# EAGLE design payload2 (EAGLE 8.3.2)
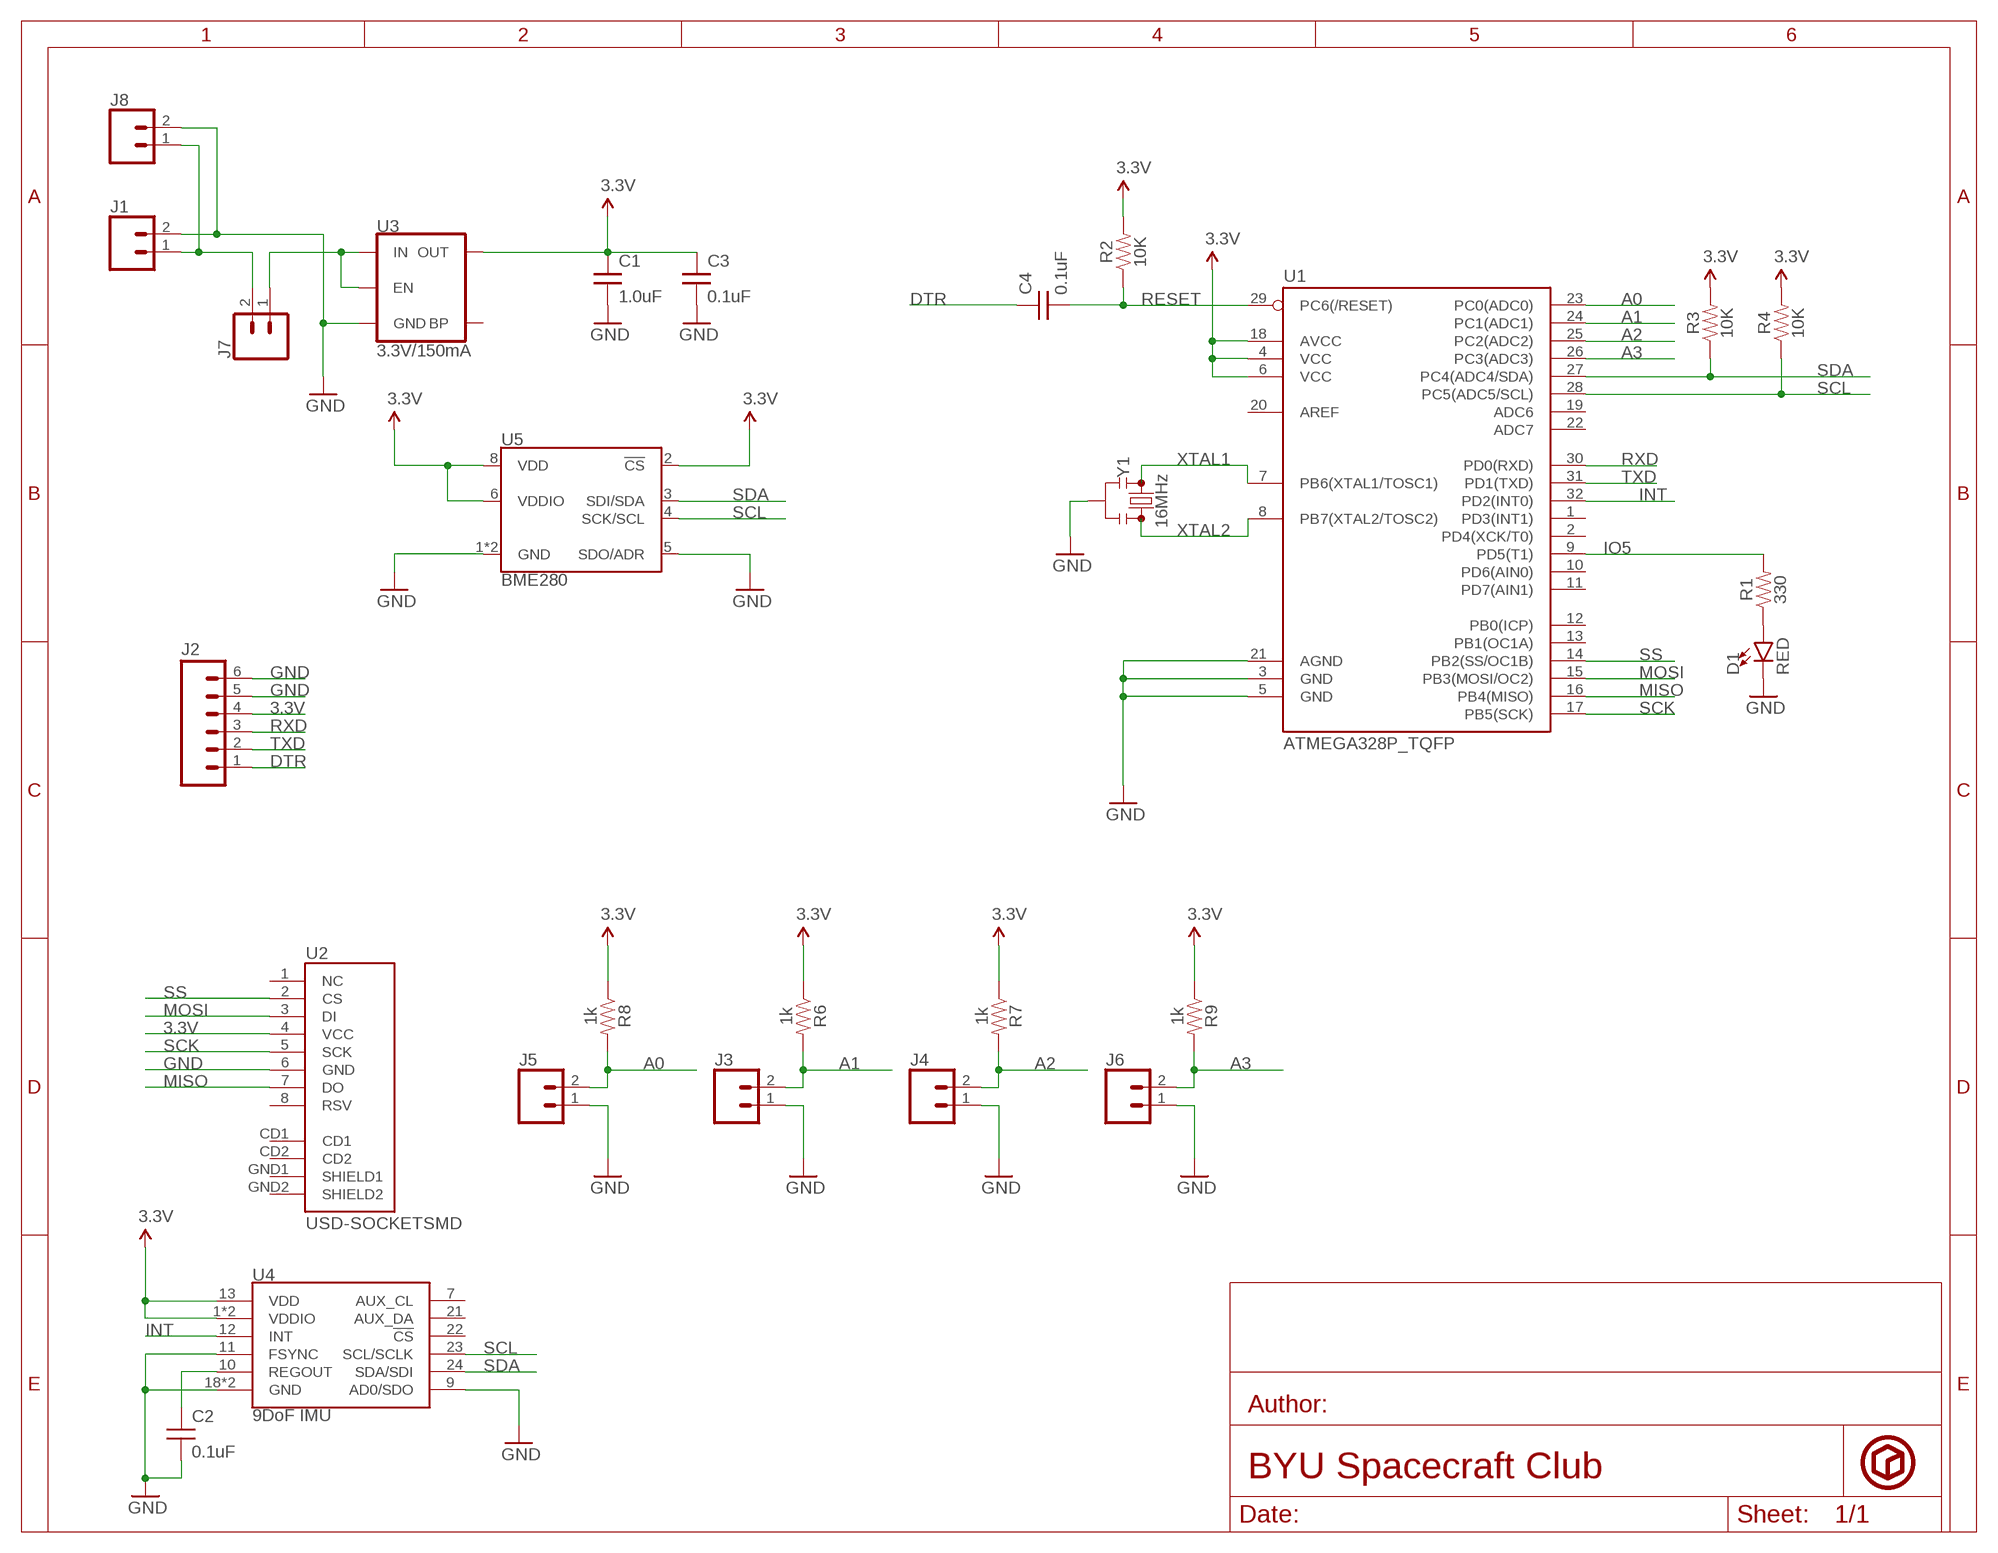
[diagram p0: schematic, sheet 1]

## Parts
C1  1.0uF  CAPACITOR_1.0UF-0603-16V-10%  [0603]
C2  0.1uF  CAPACITOR_0.1UF  [0603-CAP]
C3  0.1uF  CAPACITOR_0.1UF  [0603-CAP]
C4  0.1uF  CAPACITOR_0.1UF  [0603-CAP]
D1  RED  LED_RED0603  [LED-0603]
J1  CONN_02  [1X02]
J2  CONNECTOR_6PINSILK_FEMALE_PTH  [1X06]
J3  CONN_02  [1X02]
J4  CONN_02  [1X02]
J5  CONN_02  [1X02]
J6  CONN_02  [1X02]
J7  CONN_02  [1X02]
J8  CONN_02  [1X02]
R1  330  RESISTOR_330OHM-0603-1/10W-1%  [0603]
R2  10K  RESISTOR_10KOHM0603  [0603-RES]
R3  10K  RESISTOR_10KOHM0603  [0603-RES]
R4  10K  RESISTOR_10KOHM0603  [0603-RES]
R6  1k  RESISTOR_1KOHM-0603-1/10W-5%  [0603]
R7  1k  RESISTOR_1KOHM-0603-1/10W-5%  [0603]
R8  1k  RESISTOR_1KOHM-0603-1/10W-5%  [0603]
R9  1k  RESISTOR_1KOHM-0603-1/10W-5%  [0603]
U1  ATMEGA328P_TQFP  [TQFP32-08]
U2  USD-SOCKETSMD  [MICRO-SD-SOCKET-PP]
U3  3.3V/150mA  VOLTAGE_REGULATOR_MIC52053.3V  [SOT23-5]
U4  9DoF IMU  MPU9250  [QFN24-3X3]
U5  BME280  [LGA-8-2.5X2.5]
Y1  16MHz  RESONATOR_16MHZSMD_3.2X1.3  [RESONATOR-SMD-3.2X1.3]

## Nets
3.3V: C1.1 C3.1 J2.4 R2.2 R3.2 R4.2 R6.1 R7.1 R8.1 R9.1 U1.4(VCC) U1.6(VCC) U1.18(AVCC) U2.4(VCC) U3.5(OUT) U4.1(VDDIO) U4.8(VDDIO) U4.13(VDD) U5.2(!CS) U5.6(VDDIO) U5.8(VDD)
A0: J5.2 R8.2 U1.23(PC0(ADC0))
A1: J3.2 R6.2 U1.24(PC1(ADC1))
A2: J4.2 R7.2 U1.25(PC2(ADC2))
A3: J6.2 R9.2 U1.26(PC3(ADC3))
DTR: C4.1 J2.1
GND: C1.2 C2.2 C3.2 D1.C J1.2 J2.5 J2.6 J3.1 J4.1 J5.1 J6.1 J8.2 U1.3(GND) U1.5(GND) U1.21(AGND) U2.6(GND) U3.2(GND) U4.9(AD0/SDO) U4.11(FSYNC) U4.18(GND) U4.20(GND) U5.1(GND) U5.5(SDO/ADR) U5.7(GND) Y1.2
INT: U1.32(PD2(INT0)) U4.12(INT)
IO5: R1.2 U1.9(PD5(T1))
MISO: U1.16(PB4(MISO)) U2.7(DO)
MOSI: U1.15(PB3(MOSI/OC2)) U2.3(DI)
N$4: J7.1 U3.1(IN) U3.3(EN)
N$6: D1.A R1.1
N$7: C2.1 U4.10(REGOUT)
RESET: C4.2 R2.1 U1.29(PC6(/RESET))
RXD: J2.3 U1.30(PD0(RXD))
SCK: U1.17(PB5(SCK)) U2.5(SCK)
SCL: R4.1 U1.28(PC5(ADC5/SCL)) U4.23(SCL/SCLK) U5.4(SCK/SCL)
SDA: R3.1 U1.27(PC4(ADC4/SDA)) U4.24(SDA/SDI) U5.3(SDI/SDA)
SS: U1.14(PB2(SS/OC1B)) U2.2(CS)
TXD: J2.2 U1.31(PD1(TXD))
VIN: J1.1 J7.2 J8.1
XTAL1: U1.7(PB6(XTAL1/TOSC1)) Y1.1
XTAL2: U1.8(PB7(XTAL2/TOSC2)) Y1.3
Unconnected: U1.1(PD3(INT1)) U1.2(PD4(XCK/T0)) U1.10(PD6(AIN0)) U1.11(PD7(AIN1)) U1.12(PB0(ICP)) U1.13(PB1(OC1A)) U1.19(ADC6) U1.20(AREF) U1.22(ADC7) U2.1(NC) U2.8(RSV) U2.CD1 U2.CD2 U2.GND1(SHIELD1) U2.GND2(SHIELD2) U3.4(BP) U4.7(AUX_CL) U4.21(AUX_DA) U4.22(!CS)

## Library data of the parts
C1 = femtosat:CAPACITOR_1.0UF: 1µF ceramic capacitors A capacitor is a passive two-terminal electrical component used to store electrical energy temporarily in an electric field.; DIGIKEY: 399-3118-1-ND
C2-C4 = femtosat:CAPACITOR_0.1UF: CAP-00810 Ceramic Standard decoupling cap; DIGIKEY: 311-1343-1-ND
D1 = femtosat:LED_RED: Red SMD LED Used in manufacturing of most products at SparkFun Packages: 0603 - SMD 0603 package [Product Link] <http://docs.avagotech.com/docs/AV02-0551EN> Adapted from SparkFun Libraries; DIGIKEY: 160-1181-1-ND
J1 J3-J8 = SparkFun-Connectors:CONN_02: Multi connection point. Often used as Generic Header-pin footprint for 0.1 inch spaced/style header connections On any of the 0.1 inch spaced packages, you can populate with these: Break Away Headers - Straight <https://www.sparkfun.com/products/116> (PRT-00116) Break Away Male Headers - Right Angle <https://www.sparkfun.com/products/553> (PRT-00553) Female Headers <https://www.sparkfun.com/products/115> (PRT-00115) Break Away Headers - Machine Pin <https://www.sparkfun.com/products/117> (PRT-00117) Break Away Female Headers - Swiss Machine Pin <https://www.sparkfun.com/products/743> (PRT-00743) For SCREWTERMINALS and SPRING TERMINALS visit here: Screw Terimnals on SparkFun.com <https://www.sparkfun.com/search/results?term=Screw+Terminals> (5mm/3.5mm/2.54mm spacing) This device is also useful as a general connection point to wire up your design to another part of your project. Our various solder wires solder well into these plated through hole pads. Hook-Up Wire - Assortment (Stranded, 22 AWG) <https://www.sparkfun.com/products/11375> (PRT-11375) Hook-Up Wire - Assortment (Solid Core, 22 AWG) <https://www.sparkfun.com/products/11367> (PRT-11367) View the entire wire category on our website here <https://www.sparkfun.com/categories/141> Special notes: Molex polarized connector foot print use with: PRT-08233 with associated crimp pins and housings. 2.54_SCREWTERM for use with PRT-10571. 3.5mm Screw Terminal footprints for PRT-08084 5mm Screw Terminal footprints for use with PRT-08432
J2 = femtosat:CONNECTOR_6PIN: 6 pin connection point. Used on the femtosat for a programming connector. The ECEN shop stocks these regularly NOTES ON THE VARIANTS LOCK and LOCK_LONGPADS... This footprint was designed to help hold the alignment of a through-hole component (i.e. 6-pin header) while soldering it into place. You may notice that each hole has been shifted either up or down by 0.005 of an inch from it's more standard position (which is a perfectly straight line). This slight alteration caused the pins (the squares in the middle) to touch the edges of the holes. Because they are alternating, it causes a "brace" to hold the component in place. 0.005 has proven to be the perfect amount of "off-center" position when using our standard breakaway headers. Although looks a little odd when you look at the bare footprint, once you have a header in there, the alteration is very hard to notice. Also, if you push a header all the way into place, it is covered up entirely on the bottom side.
R1 = femtosat:RESISTOR_330OHM: 330 Ohm resistor A resistor is a passive two-terminal electrical component that implements electrical resistance as a circuit element. Resistors act to reduce current flow, and, at the same time, act to lower voltage levels within circuits. - Wikipedia; DIGIKEY: 311-330GRCT-ND
R2-R4 = femtosat:RESISTOR_10KOHM: 10k Ohm Resistor; DIGIKEY: 311-10KGRCT-ND
R6-R9 = femtosat:RESISTOR_1KOHM: 1k Ohm resistor A resistor is a passive two-terminal electrical component that implements electrical resistance as a circuit element. Resistors act to reduce current flow, and, at the same time, act to lower voltage levels within circuits. - Wikipedia; DIGIKEY: 311-1.0KGRCT-ND
U1 = femtosat:ATMEGA328P_TQFP: ATMEGA 328P Microcontroller in QFP package Adapted from SparkFun libraries; DIGIKEY: ATMEGA328P-AURCT-ND
U2 = microSD-Breakout-v14:USD-SOCKET: microSD Socket Push-push type uSD socket. Schematic element and footprint production proven. Spark Fun Electronics SKU : PRT-00127. tDoc lines correctly indicate media card edge positions when inserting (unlocked, locked, depressed).
U3 = femtosat:VOLTAGE_REGULATOR_MIC5205: V_REG MIC5205 Standard 3.3V, 5V, and Adjustable 150mA LDO voltage regulator in SOT-23 layout. Micrel part MIC5205. BP (by-pass) pin is used to lower output noise with 470pF cap, may be left open. On the adjustable version BP is used to set output. Adapted from SparkFun Libraries; DIGIKEY: 576-1259-1-ND
U4 = femtosat:MPU9250: MPU-9250 9 Degree of Freedom IMU System in Package that contains MPU-6500 & AK8963 NC pin 19. 2-6 & 14-17 not internally connected. May be used for PCB trace routing. Datasheet <https://cdn.sparkfun.com/assets/learn_tutorials/5/5/0/MPU9250REV1.0.pdf> Adapted from SparkFun Libraries; DIGIKEY: 1428-1019-1-ND
U5 = femtosat:BME280: Bosch BME280 – Combined Humidity and Pressure Sensor The BME280 is as combined digital humidity, pressure and temperature sensor based on proven sensing principles. The sensor module is housed in an extremely compact metal-lid LGA package with a footprint of only 2.5×2.5mm² with a height of 0.93mm. Its small dimensions and its low power consumption allow the implementation in battery driven devices such as handsets, GPS modules or watches. Datasheet <https://cdn.sparkfun.com/assets/learn_tutorials/4/1/9/BST-BME280_DS001-10.pdf> Adapted from the SparkFun Libraries; DIGIKEY: 828-1063-1-ND
Y1 = femtosat:RESONATOR_16MHZ: 16MHz Resonator Digikey Example <http://www.digikey.com/product-detail/en/murata-electronics-north-america/CSTCE16M0V53-R0/490-1198-1-ND/584635> Frequency: 16MHz Frequency Stability: ±0.3% Frequency Tolerance: ±0.5% Capacitance: 15pF Adapted from SparkFun Libraries; DIGIKEY: 490-1198-1-ND

## Board
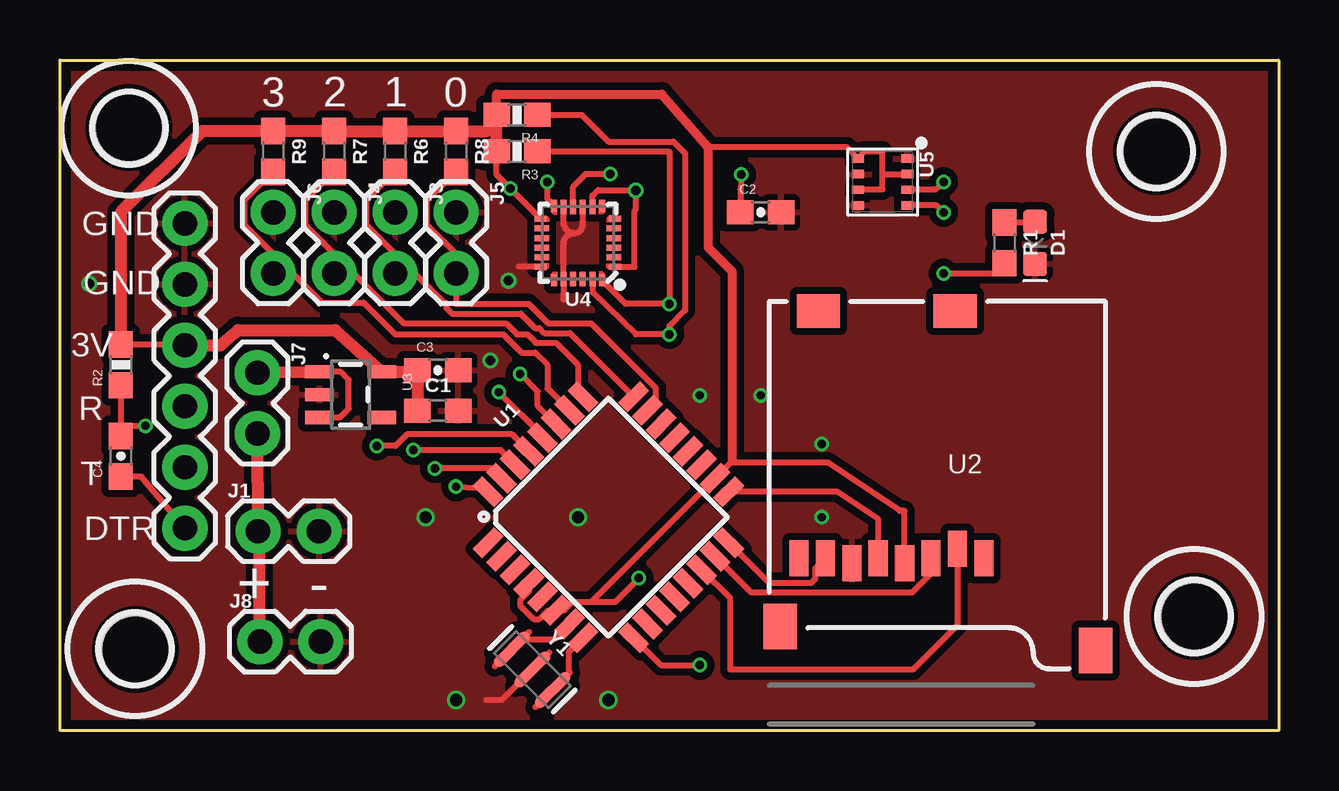
[diagram p1: board, top side]
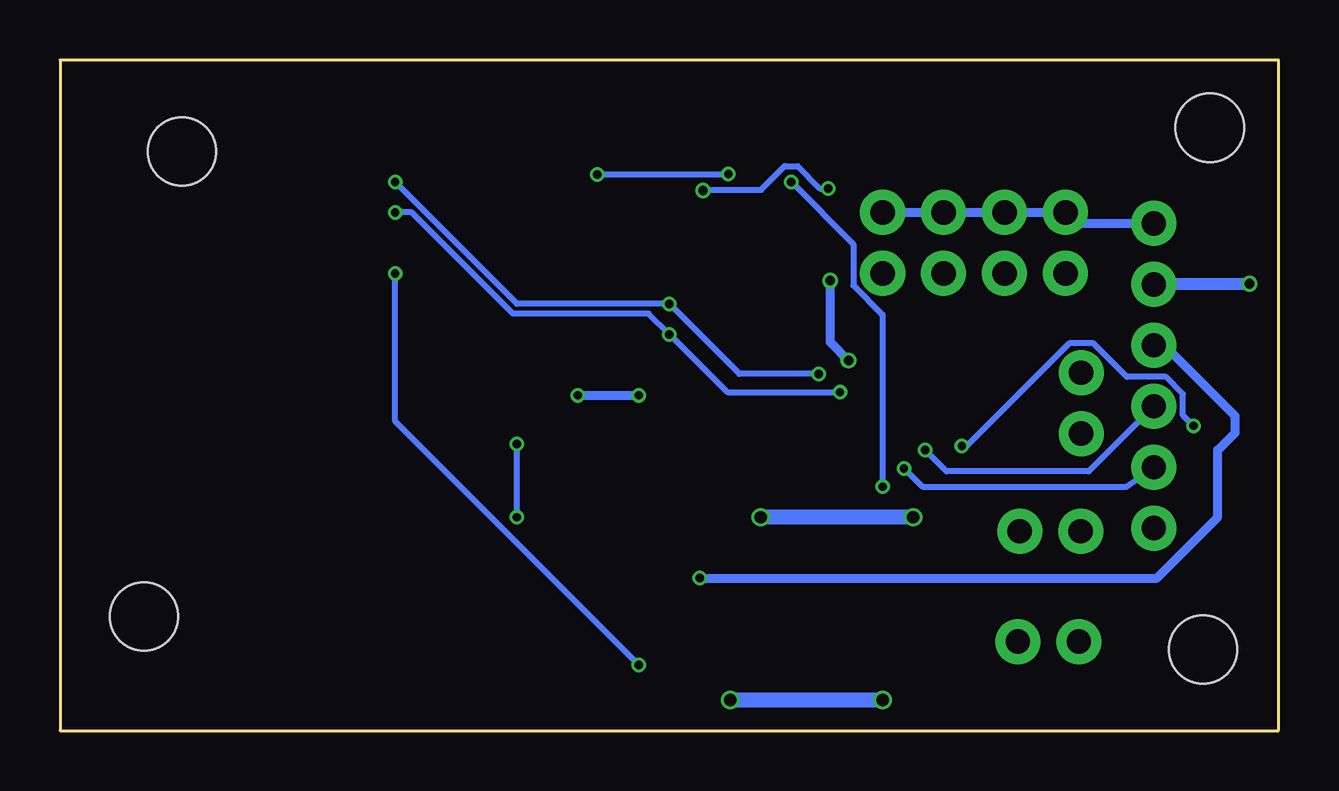
[diagram p2: board, bottom side, seen from below]

Size 50.8 x 27.94 mm. Coordinates in mm from the lower left corner, seen from the top.
Outline: 0,0 0,27.94 50.8,27.94 50.8,0 0,0
Copper layers (1*16): Top 0.035559375mm / dielectric 1.6mm / Bottom 0.035559375mm
Design rules "oshpark-2layer *": minimum track width 6mil, minimum drill 10mil, track to track 6mil, track to pad 6mil, pad to pad 6mil, via to via 6mil, smd to smd 6mil, copper to edge 15mil, drill to drill 6mil, minimum pad ring 5mil, minimum via ring 5mil, stop-mask expansion 2.5mil, vias tented up to drill 21mil, thermal gap 10mil
Holes 2.84 mm at 3.15,3.38 2.87,25.12 45.72,24.13 47.29,4.75

### Footprints (pad centres in the part's own frame; a part is rotated, then mirrored left to right if it is on the bottom)
0603 = smd 1.1 x 1: 1 -0.85,0; 2 0.85,0
0603-CAP = smd 1.1 x 1: 1 -0.85,0; 2 0.85,0
LED-0603 = smd 1 x 1: A -0.877,0; C 0.877,0
1X02 = drill 1.016 pad 1.88: 1 0,0; 2 2.54,0
1X06 = drill 1.016 pad 1.88: 1 -6.35,0; 2 -3.81,0; 3 -1.27,0; 4 1.27,0; 5 3.81,0; 6 6.35,0
0603-RES = smd 1.1 x 1: 1 -0.85,0; 2 0.85,0
TQFP32-08 = smd 1.27 x 0.559: 1 -4.293,2.8; 2 -4.293,2; 3 -4.293,1.2; 4 -4.293,0.4; 5 -4.293,-0.4; 6 -4.293,-1.2; 7 -4.293,-2; 8 -4.293,-2.8; 17 4.293,-2.8; 18 4.293,-2; 19 4.293,-1.2; 20 4.293,-0.4; 21 4.293,0.4; 22 4.293,1.2; 23 4.293,2; 24 4.293,2.8 | smd 0.559 x 1.27: 9 -2.8,-4.293; 10 -2,-4.293; 11 -1.2,-4.293; 12 -0.4,-4.293; 13 0.4,-4.293; 14 1.2,-4.293; 15 2,-4.293; 16 2.8,-4.293; 25 2.8,4.293; 26 2,4.293; 27 1.2,4.293; 28 0.4,4.293; 29 -0.4,4.293; 30 -1.2,4.293; 31 -2,4.293; 32 -2.8,4.293
MICRO-SD-SOCKET-PP = smd 0.8 x 1.5: 1 -8.94,10.7; 2 -7.84,10.3; 3 -6.74,10.7; 4 -5.64,10.9; 5 -4.54,10.7; 6 -3.44,10.9; 7 -2.34,10.7; 8 -1.24,10.7 | smd 1.8 x 1.4: CD1 -7.75,0.4; CD2 -2.05,0.4 | smd 1.4 x 1.9: GND1 -13.6,14.55; GND2 -0.45,13.55
SOT23-5 = smd 0.55 x 1.2: 1 -0.95,-1.3; 2 0,-1.3; 3 0.95,-1.3; 4 0.95,1.3; 5 -0.95,1.3
QFN24-3X3 = smd 0.495 x 0.25: 1 -1.552,1; 6 -1.552,-1; 13 1.552,-1; 18 1.552,1 | smd 0.6 x 0.25: 2 -1.5,0.6; 3 -1.5,0.2; 4 -1.5,-0.2; 5 -1.5,-0.6; 14 1.5,-0.6; 15 1.5,-0.2; 16 1.5,0.2; 17 1.5,0.6 | smd 0.25 x 0.495: 7 -1,-1.552; 12 1,-1.552; 19 1,1.552; 24 -1,1.552 | smd 0.25 x 0.6: 8 -0.6,-1.5; 9 -0.2,-1.5; 10 0.2,-1.5; 11 0.6,-1.5; 20 0.6,1.5; 21 0.2,1.5; 22 -0.2,1.5; 23 -0.6,1.5
LGA-8-2.5X2.5 = smd 0.35 x 0.5: 1 -0.975,1.025; 2 -0.325,1.025; 3 0.325,1.025; 4 0.975,1.025; 5 0.975,-1.025; 6 0.325,-1.025; 7 -0.325,-1.025; 8 -0.975,-1.025
RESONATOR-SMD-3.2X1.3 = smd 0.45 x 1.905: 1 -1.2,0; 2 0,0; 3 1.2,0

### Placement (x,y rotation side)
C1  15.75,13.34 0 top
C2  29.21,21.59 0 top
C3  15.75,15.01 0 top
C4  2.54,11.43 90 top
D1  40.64,20.32 270 top
J1  8.26,8.31 0 top
J2  5.21,14.78 90 top
J3  13.97,21.59 270 top
J4  11.43,21.59 270 top
J5  16.51,21.59 270 top
J6  8.89,21.59 270 top
J7  8.23,14.91 270 top
J8  8.33,3.71 0 top
R1  39.37,20.32 270 top
R2  2.54,15.24 90 top
R3  19.05,24.13 180 top
R4  19.05,25.65 180 top
R6  13.97,24.13 270 top
R7  11.43,24.13 270 top
R8  16.51,24.13 270 top
R9  8.89,24.13 270 top
U1  22.86,8.89 45 top
U2  29.57,17.88 180 top
U3  12.12,14 270 top
U4  21.59,20.32 180 top
U5  34.29,22.86 270 top
Y1  19.68,2.54 315 top

### Tracks (layer width: path | path; a pad name or v marks a point on that pad's centre or on a via)
3.3V  (via drill 0.35, 0.38)
  Top 0.254: R2.2 4.66,16.09 J2.4 | U4.1 23.95,19.32 23.95,21.67 24,21.71 v24,22.5 22.45,22.5 22.43,22.53 22.19,22.29 U4.8 | U4.13 v18.77,22.58 18.2,23.16 R3.2 | U1.4 19.54,5.8 19.18,5.44 19.18,5.21 19.74,4.65 19.97,4.65 20.33,5.01 U1.6 21.01,5.01 21.38,5.37 22.16,5.37 U1.18 27.98,11.18 28.01,11.18 | 21.59,5.37 23.15,5.37 v24.13,6.35 | 28.01,11.18 32,11.18 35.01,9.16 35.21,9.16 U2.4 | 28.01,11.43 28.01,11.18 | 34.29,23.18 34.29,24.13 33.56,24.13 U5.8 32.79,24.31 27.02,24.31 | 34.29,23.18 U5.2 | U5.6 34.29,22.54 34.29,23.18
  Top 0.381: 18.36,25.4 R4.2 18.2,26.52 25.08,26.52 27.02,24.31 27.02,20.13 28.01,19.13 28.01,11.43 28.01,11.24
  Top 0.508: C1.1 C3.1 14.9,14.95 U3.5 11.47,16.69 7.42,16.69 6.68,16.05 J2.4 | R3.2 R4.2 17.78,24.98 R8.1 R6.1 R7.1 R9.1 5.93,24.98 2.54,21.59 R2.2
  Bottom 0.254: v18.77,22.58 19.11,22.58 20.05,23.52 20.59,23.52 21.58,22.53 24,22.53 v24,22.5
  Bottom 0.381: v24.13,6.35 5.08,6.35 2.54,8.89 2.54,11.68 1.82,12.4 1.82,13.1 5.08,16.36 J2.4
A0
  Top 0.254: R8.2 16.04,22.81 16,22.81 15.29,22.09 15.29,21.09 16.51,19.87 J5.2 16.51,17.78 19.54,17.78 20.35,16.97 22.14,16.97 24.84,14.27 24.84,13.7 U1.23
A1
  Top 0.254: R6.2 13.5,22.81 13.46,22.81 12.75,22.09 12.75,21.09 13.97,19.87 J3.2 14.79,19.05 16,17.83 16.05,17.83 16.1,17.78 16.1,17.61 16.34,17.37 19.2,17.37 19.81,16.76 19.98,16.76 20.18,16.56 21.26,16.56 U1.24
A2
  Top 0.254: R7.2 10.96,22.81 10.93,22.81 10.21,22.09 10.21,21.09 11.43,19.87 J4.2 12.25,19.05 14.33,16.97 18.59,16.97 19.05,16.51 19.49,16.51 19.84,16.16 20.67,16.16 21.59,15.24 21.59,14.12 U1.25
A3
  Top 0.254: R9.2 8.42,22.81 8.38,22.81 7.67,22.09 7.67,21.09 8.89,19.87 J6.2 9.71,19.05 10.93,17.83 12.65,17.83 13.97,16.51 18.48,16.51 19.23,15.75 19.81,15.75 20.32,15.24 20.32,14.26 U1.26
DTR
  Top 0.254: J2.1 3.39,10.58 C4.1
GND  (via drill 0.35, 0.4, 0.51)
  Top 0.254: U4.9 21.79,21.08 arc-90 21.44,20.73 | 21.44,20.73 arc-90 20.99,21.17 U4.11 | U4.18 20.03,19.33 19.13,19.33 | 20.98,17.96 U4.20 20.99,20.28 arc-90 21.44,20.73 | v31.75,8.88 v31.75,8.89 | Y1.2 18.41,1.27 17.78,1.27
  Bottom 0.254: v31.75,8.89 v31.75,11.94
  Bottom 0.381: v29.21,13.97 v26.67,13.97 | v17.93,15.42 18.69,16.18 v18.69,18.75 | J5.1 J3.1 J4.1 J6.1 8.43,21.13 J2.6
  Bottom 0.508: J2.5 5.18,18.62 v1.22,18.62
  Bottom 0.635: v16.51,1.27 v22.86,1.27 | v15.24,8.89 v21.59,8.89
  pour Top (isolate 0.305): 0,0 0,27.94 50.8,27.94 50.8,0
INT  (via drill 0.35)
  Top 0.254: U4.12 20.32,22.14 v20.32,22.86 | v16.51,10.16 17.84,10.1 U1.32
  Bottom 0.254: v20.32,22.86 17.73,20.27 17.73,18.55 16.51,17.33 v16.51,10.16
IO5  (via drill 0.35)
  Top 0.254: U1.9 25.06,2.73 v26.67,2.73 | v36.83,19.05 38.95,19.05 R1.2
  Bottom 0.254: v26.67,2.73 36.83,12.89 v36.83,19.05
MISO
  Top 0.254: U2.7 31.48,6.76 31.48,6.32 31.32,6.15 29.56,6.15 U1.16
MOSI
  Top 0.254: U2.3 36.31,6.54 35.52,5.75 29.21,5.75 28.83,5.75 U1.15
N$4
  Top 0.254: U3.3 11.67,13.04 12.04,13.41 12.04,14.61 11.7,14.95 U3.1
  Top 0.508: J7.1 8.57,14.92 U3.1
N$6
  Top 0.254: R1.1 40.61,21.17 D1.A
N$7  (via drill 0.35)
  Top 0.254: U4.10 21.39,22.66 21.92,23.19 v22.94,23.19 | v28.4,23.16 28.36,22.54 C2.1
  Bottom 0.254: v22.94,23.19 22.96,23.16 v28.4,23.16
RESET  (via drill 0.35)
  Top 0.254: v13.21,11.86 13.98,11.86 14.46,12.34 18.84,12.34 U1.29 | R2.1 C4.2 2.96,12.7 v3.56,12.7
  Bottom 0.254: v3.56,12.7 3.99,13.13 3.99,14.02 4.7,14.73 6.33,14.73 7.72,16.13 8.73,16.13 13,11.86 v13.21,11.86
RXD  (via drill 0.35)
  Top 0.254: U1.30 18.37,11.68 v14.73,11.68
  Bottom 0.254: v14.73,11.68 13.84,10.79 7.92,10.79 J2.3
SCK
  Top 0.254: U1.17 32.4,9.95 34.11,8.8 U2.5
SCL  (via drill 0.35)
  Top 0.254: U4.23 22.21,18.75 22.2,18.26 24,16.51 v25.4,16.51 25.4,16.85 26.06,17.51 26.06,24.05 25.57,24.54 22.86,24.54 21.74,25.65 R4.1 | v18.29,14.1 20.11,12.28 U1.28 | v36.83,21.59 36.53,21.89 U5.4
  Bottom 0.254: v18.29,14.1 22.99,14.1 v25.4,16.51 26.26,17.37 31.92,17.37 36.13,21.59 v36.83,21.59
SDA  (via drill 0.35)
  Top 0.254: U4.24 23.58,17.78 v25.4,17.78 25.4,24.13 R3.1 | v19.18,14.86 19.91,14.12 19.91,13.53 U1.27 | v36.83,22.86 36.51,22.54 U5.3
  Bottom 0.254: v19.18,14.86 22.48,14.86 v25.4,17.78 31.75,17.78 v36.83,22.86
SS
  Top 0.254: U1.14 27.94,5.51 27.94,2.54 35.56,2.54 37.41,4.39 U2.2
TXD  (via drill 0.35)
  Top 0.254: U1.31 18,10.92 v15.62,10.92
  Bottom 0.254: v15.62,10.92 14.86,10.16 6.35,10.16 J2.2
VIN
  Top 0.508: J7.2 J1.1 8.33,8.31 J8.1
XTAL1
  Top 0.254: Y1.1 19.26,3.81 20.61,3.81 U1.7
XTAL2
  Top 0.254: 21.78,3.88 U1.8 21.21,3.28 21.21,2.37 Y1.3

### Text on the board
tPlace: 3 | 2 | 1 | 0 | GND | GND | 3V | R | T | DTR | + | -